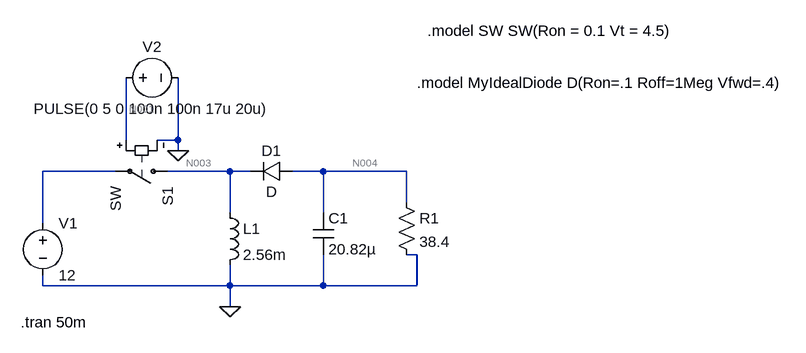
[diagram p0: schematic Draft1.asc]
Draft1.asc, the LTspice schematic file:
Version 4
SHEET 1 1472 680
WIRE 176 -16 176 -112
WIRE 256 -16 256 -112
WIRE 256 -16 224 -16
WIRE 256 0 256 -16
WIRE 160 32 48 32
WIRE 336 32 240 32
WIRE 368 32 336 32
WIRE 480 32 432 32
WIRE 608 32 480 32
WIRE 608 80 608 32
WIRE 336 96 336 32
WIRE 480 96 480 32
WIRE 48 112 48 32
WIRE 624 160 608 160
WIRE 48 208 48 192
WIRE 336 208 336 176
WIRE 336 208 48 208
WIRE 480 208 480 160
WIRE 480 208 336 208
WIRE 624 208 624 160
WIRE 624 208 480 208
WIRE 336 240 336 208
FLAG 336 240 0
FLAG 256 0 0
SYMBOL voltage 48 96 R0
WINDOW 123 0 0 Left 0
WINDOW 39 0 0 Left 0
SYMATTR InstName V1
SYMATTR Value 12
SYMBOL ind 320 80 R0
SYMATTR InstName L1
SYMATTR Value 2.56m
SYMBOL voltage 160 -112 R270
WINDOW 0 32 56 VTop 2
WINDOW 3 -32 56 VBottom 2
WINDOW 123 0 0 Left 0
WINDOW 39 0 0 Left 0
SYMATTR InstName V2
SYMATTR Value PULSE(0 5 0 100n 100n 17u 20u)
SYMBOL cap 464 96 R0
SYMATTR InstName C1
SYMATTR Value 20.82µ
SYMBOL res 592 64 R0
SYMATTR InstName R1
SYMATTR Value 38.4
SYMBOL diode 432 16 R90
WINDOW 0 0 32 VBottom 2
WINDOW 3 32 32 VTop 2
SYMATTR InstName D1
SYMBOL sw 256 32 R90
SYMATTR InstName S1
TEXT 14 264 Left 2 !.tran 50m
TEXT 624 -104 Left 2 !.model MyIdealDiode D(Ron=.1 Roff=1Meg Vfwd=.4)
TEXT 640 -184 Left 2 !.model SW SW(Ron = 0.1 Vt = 4.5)

The netlist it stands for:
* Draft1.asc
V1 N002 0 12
L1 N003 0 2.56m
V2 N001 0 PULSE(0 5 0 100n 100n 17u 20u)
C1 N004 0 20.82µ
R1 N004 0 38.4
D1 N004 N003 D
S1 N003 N002 N001 0 SW
.model D D
.lib standard.dio
.tran 50m
.model MyIdealDiode D(Ron=.1 Roff=1Meg Vfwd=.4)
.model SW SW(Ron = 0.1 Vt = 4.5)
.backanno
.end

* Results of the author's LTspice run, read from the files saved beside the schematic
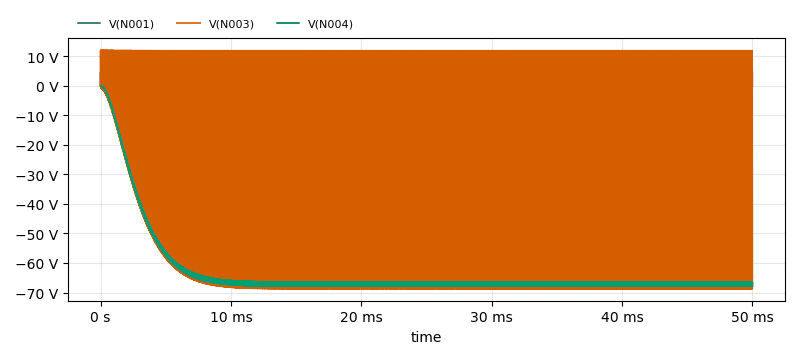
[diagram p1: Transient Analysis of Draft1.asc, plotted from the saved traces]
* Transient Analysis, 1 run:
*   V(N001): min 0 V, max 5 V, average 4.275 V, rms 4.621 V, last 0 V
*   V(N003): min -68.74 V, max 12 V, average 639.5 mV, rms 27.37 V, last -68.73 V
*   V(N004): min -67.87 V, max 0 V, average -63.13 V, rms 64.35 V, last -67.83 V